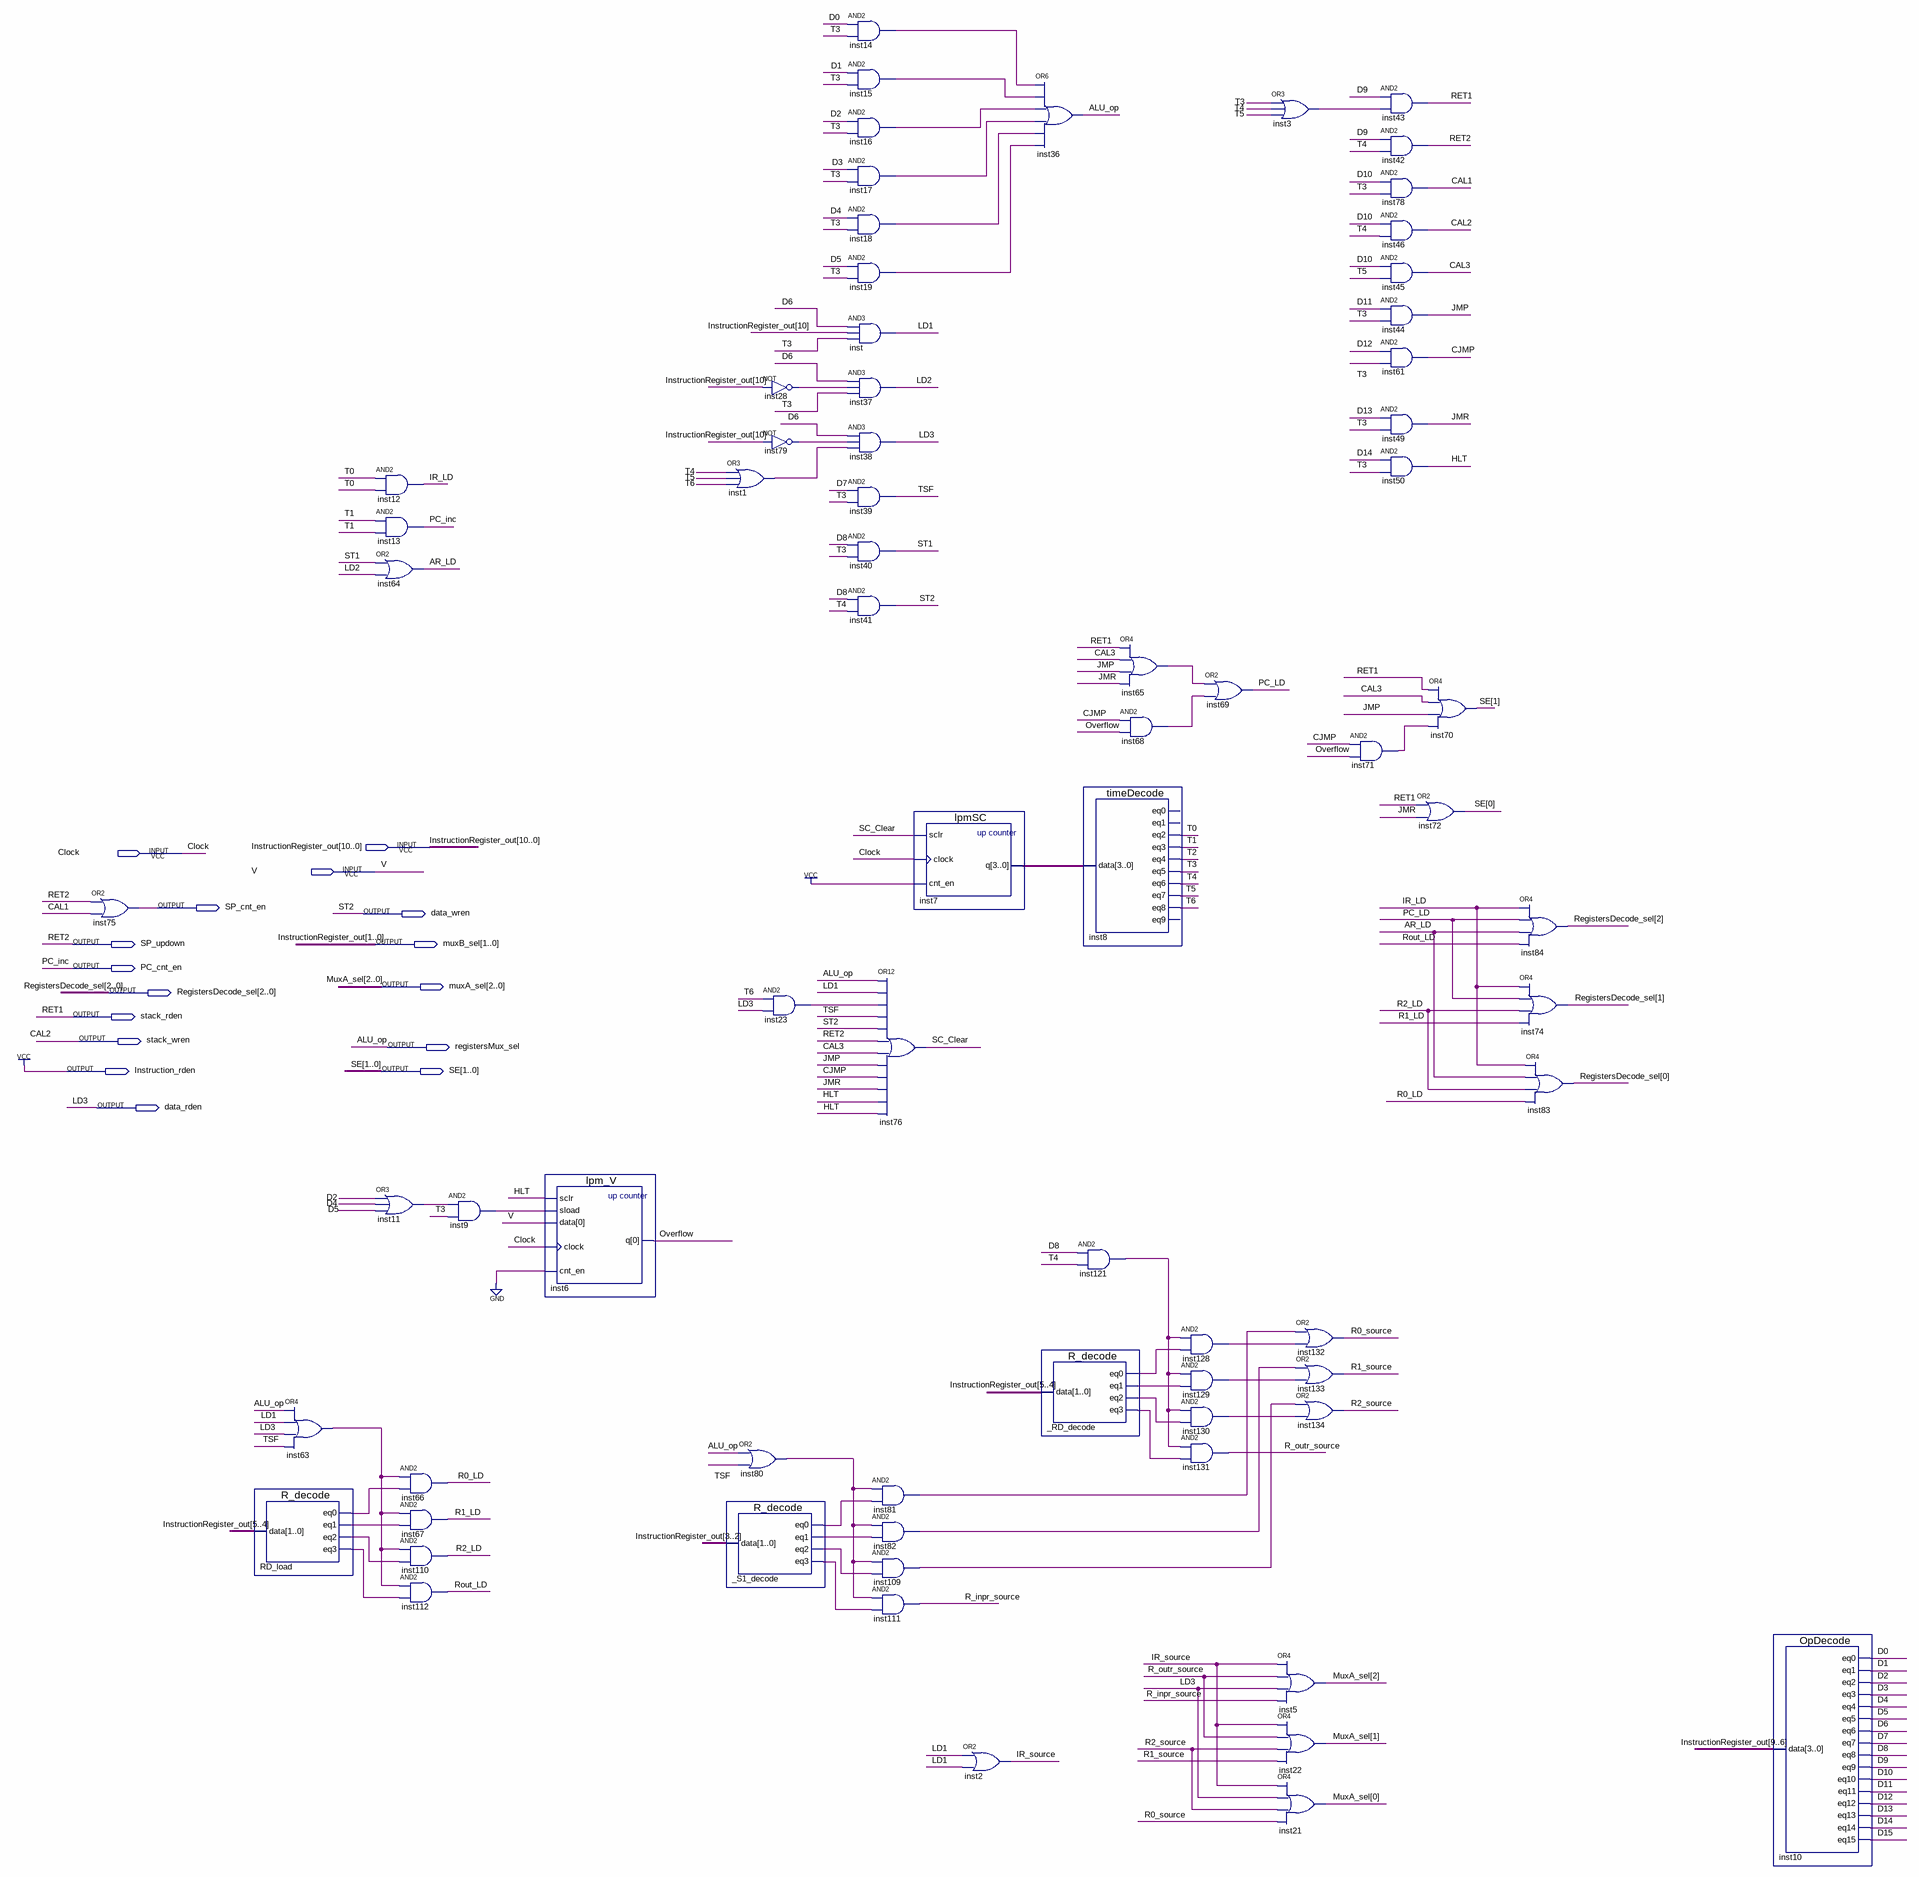
[diagram p0: schematic sheet]
// Quartus schematic CU_Mesut_Selim_Serbes_2017510100.bdf as structural Verilog: 72 symbols, 16 pins
module CU_Mesut_Selim_Serbes_2017510100 (
  input  [10:0] InstructionRegister_out,
  input  Clock,
  input  V,
  output SP_cnt_en,
  output data_wren,
  output SP_updown,
  output [1:0] muxB_sel,
  output PC_cnt_en,
  output [2:0] muxA_sel,
  output [2:0] RegistersDecode_sel,
  output stack_rden,
  output stack_wren,
  output registersMux_sel,
  output Instruction_rden,
  output [1:0] SE,
  output data_rden
);

  wire _RD_decode_eq0, _RD_decode_eq1, _RD_decode_eq2, _RD_decode_eq3, _S1_decode_eq0, _S1_decode_eq1,
       _S1_decode_eq2, _S1_decode_eq3, AR_LD, CAL1, CAL3, CJMP, D0, D1, D2, D3, D4, D5, D6, D7, D8, D9, D10,
       D11, D12, D13, D14, D15, HLT, inst1_out, inst3_out, inst9_out, inst11_out, inst14_out, inst15_out,
       inst16_out, inst17_out, inst18_out, inst19_out, inst23_out, inst28_out, inst63_out, inst65_out,
       inst68_out, inst71_out, inst79_out, inst80_out, inst81_out, inst82_out, inst109_out, inst121_out,
       inst128_out, inst129_out, inst130_out, IR_LD, IR_source, JMP, JMR, LD1, LD2, Overflow, PC_LD, R0_LD,
       R0_source, R1_LD, R1_source, R2_LD, R2_source, R_inpr_source, R_outr_source, RD_load_eq0, RD_load_eq1,
       RD_load_eq2, RD_load_eq3, Rout_LD, SC_Clear, ST1, T0, T1, T2, T3, T4, T5, T6, TSF;
  wire [3:0] inst7_q;

  or inst75 (SP_cnt_en, SP_updown, CAL1);
  R_decode RD_load (
    .data(InstructionRegister_out[5:4]), .eq0(RD_load_eq0), .eq1(RD_load_eq1), .eq2(RD_load_eq2),
    .eq3(RD_load_eq3));
  or inst63 (inst63_out, registersMux_sel, LD1, data_rden, TSF);
  and inst12 (IR_LD, T0, T0);
  and inst13 (PC_cnt_en, T1, T1);
  or inst64 (AR_LD, ST1, LD2);
  or inst11 (inst11_out, D2, D4, D5);
  and inst66 (R0_LD, inst63_out, RD_load_eq0);
  and inst67 (R1_LD, inst63_out, RD_load_eq1);
  and inst110 (R2_LD, inst63_out, RD_load_eq2);
  and inst112 (Rout_LD, inst63_out, RD_load_eq3);
  and inst9 (inst9_out, inst11_out, T3);
  lpm_V inst6 (.sclr(HLT), .sload(inst9_out), .data(V), .clock(Clock), .cnt_en(1'b0), .q(Overflow));
  or inst1 (inst1_out, T4, T5, T6);
  or inst80 (inst80_out, registersMux_sel, TSF);
  R_decode _S1_decode (
    .data(InstructionRegister_out[3:2]), .eq0(_S1_decode_eq0), .eq1(_S1_decode_eq1), .eq2(_S1_decode_eq2),
    .eq3(_S1_decode_eq3));
  not inst28 (inst28_out, InstructionRegister_out[10]);
  not inst79 (inst79_out, InstructionRegister_out[10]);
  and inst23 (inst23_out, T6, data_rden);
  and inst14 (inst14_out, D0, T3);
  and inst15 (inst15_out, D1, T3);
  and inst16 (inst16_out, D2, T3);
  and inst17 (inst17_out, D3, T3);
  and inst18 (inst18_out, D4, T3);
  and inst19 (inst19_out, D5, T3);
  and inst (LD1, D6, InstructionRegister_out[10], T3);
  and inst37 (LD2, D6, inst28_out, T3);
  and inst38 (data_rden, D6, inst79_out, inst1_out);
  and inst39 (TSF, D7, T3);
  and inst40 (ST1, D8, T3);
  and inst41 (data_wren, D8, T4);
  or inst76 (SC_Clear, registersMux_sel, LD1, inst23_out, TSF, data_wren, SP_updown, CAL3, JMP, CJMP, JMR, HLT, HLT);
  and inst81 (inst81_out, inst80_out, _S1_decode_eq0);
  and inst82 (inst82_out, inst80_out, _S1_decode_eq1);
  and inst109 (inst109_out, inst80_out, _S1_decode_eq2);
  and inst111 (R_inpr_source, inst80_out, _S1_decode_eq3);
  lpmSC inst7 (.sclr(SC_Clear), .clock(Clock), .cnt_en(1'b1), .q(inst7_q));
  or inst2 (IR_source, LD1, LD1);
  or inst36 (registersMux_sel, inst14_out, inst15_out, inst16_out, inst17_out, inst18_out, inst19_out);
  R_decode _RD_decode (
    .data(InstructionRegister_out[5:4]), .eq0(_RD_decode_eq0), .eq1(_RD_decode_eq1), .eq2(_RD_decode_eq2),
    .eq3(_RD_decode_eq3));
  timeDecode inst8 (
    .data(inst7_q), .eq2(T0), .eq3(T1), .eq4(T2), .eq5(T3), .eq6(T4), .eq7(T5), .eq8(T6));  // open: eq0, eq1, eq9
  and inst121 (inst121_out, D8, T4);
  or inst65 (inst65_out, stack_rden, CAL3, JMP, JMR);
  and inst68 (inst68_out, CJMP, Overflow);
  and inst128 (inst128_out, inst121_out, _RD_decode_eq0);
  and inst129 (inst129_out, inst121_out, _RD_decode_eq1);
  and inst130 (inst130_out, inst121_out, _RD_decode_eq2);
  and inst131 (R_outr_source, inst121_out, _RD_decode_eq3);
  or inst69 (PC_LD, inst65_out, inst68_out);
  or inst3 (inst3_out, T3, T4, T5);
  or inst5 (muxA_sel[2], IR_source, R_outr_source, data_rden, R_inpr_source);
  or inst22 (muxA_sel[1], IR_source, R_outr_source, R2_source, R1_source);
  or inst21 (muxA_sel[0], IR_source, data_rden, R2_source, R0_source);
  or inst132 (R0_source, inst81_out, inst128_out);
  or inst133 (R1_source, inst82_out, inst129_out);
  or inst134 (R2_source, inst109_out, inst130_out);
  and inst43 (stack_rden, D9, inst3_out);
  and inst42 (SP_updown, D9, T4);
  and inst78 (CAL1, D10, T3);
  and inst46 (stack_wren, D10, T4);
  and inst45 (CAL3, D10, T5);
  and inst44 (JMP, D11, T3);
  and inst61 (CJMP, D12, T3);
  and inst49 (JMR, D13, T3);
  and inst50 (HLT, D14, T3);
  and inst71 (inst71_out, CJMP, Overflow);
  or inst70 (SE[1], stack_rden, CAL3, JMP, inst71_out);
  or inst72 (SE[0], stack_rden, JMR);
  or inst84 (RegistersDecode_sel[2], IR_LD, PC_LD, AR_LD, Rout_LD);
  or inst74 (RegistersDecode_sel[1], IR_LD, PC_LD, R2_LD, R1_LD);
  or inst83 (RegistersDecode_sel[0], IR_LD, AR_LD, R2_LD, R0_LD);
  OpDecode inst10 (
    .data(InstructionRegister_out[9:6]), .eq0(D0), .eq1(D1), .eq2(D2), .eq3(D3), .eq4(D4), .eq5(D5),
    .eq6(D6), .eq7(D7), .eq8(D8), .eq9(D9), .eq10(D10), .eq11(D11), .eq12(D12), .eq13(D13), .eq14(D14),
    .eq15(D15));

  assign Instruction_rden = 1'b1;
  assign muxB_sel = InstructionRegister_out[1:0];

  // Other names for the same wires on the sheet: ALU_op = registersMux_sel; CAL2 = stack_wren; LD3 = data_rden;
  //   PC_inc = PC_cnt_en; RET1 = stack_rden; RET2 = SP_updown; ST2 = data_wren
endmodule
